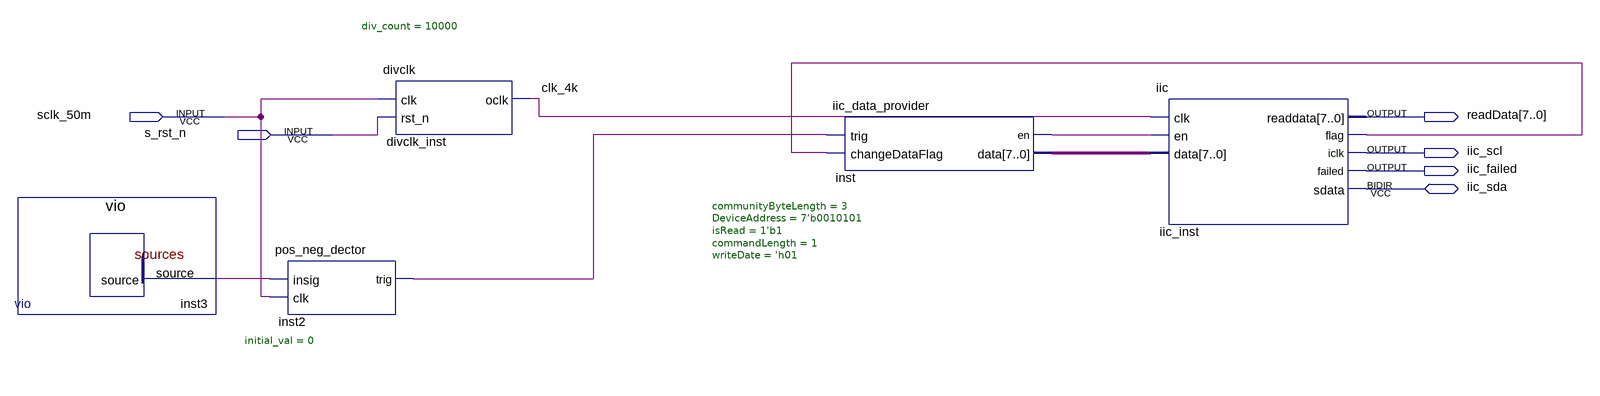
[diagram p0: schematic sheet]
// Quartus schematic eeprom_test.bdf as structural Verilog: 5 symbols, 6 pins
module eeprom_test (
  input  sclk_50m,
  input  s_rst_n,
  inout  iic_sda,
  output [7:0] readData,
  output iic_scl,
  output iic_failed
);

  wire clk_4k, iic_inst_flag, inst2_trig, inst3_source, inst_en;
  wire [7:0] inst_data;

  vio inst3 (.source(inst3_source));
  pos_neg_dector #(.initial_val(0)) inst2 (.insig(inst3_source), .clk(sclk_50m), .trig(inst2_trig));
  divclk #(.div_count(10000)) divclk_inst (.clk(sclk_50m), .rst_n(s_rst_n), .oclk(clk_4k));
  iic_data_provider #(.communityByteLength(3), .DeviceAddress(7'b0010101), .isRead(1'b1), .commandLength(1), .writeDate('h01)) inst (
    .trig(inst2_trig), .changeDataFlag(iic_inst_flag), .en(inst_en), .data(inst_data));
  iic iic_inst (
    .clk(clk_4k), .en(inst_en), .data(inst_data), .readdata(readData), .flag(iic_inst_flag), .iclk(iic_scl),
    .failed(iic_failed), .sdata(iic_sda));
endmodule
